# Altium schematic sheet led_VDC.SchDoc
size A; SheetNumber: 12; SheetTotal: 12; SPICEModelCacheQAAZNQEN: <root> / <DocumentId>QAAZNQEN</DocumentId> / <CacheFrame Number="0"> / <Model Name="led0" Kind="MDL"> / <Text>*Typ INFRARED GaAs LED: Vf=1.2V Vr=5V If=40mA trr=3uS / *LED Pinout: 1=A, 2=K / .MODEL LED0 D (IS=93.5P RS=84M N=2.63 BV=5 IBV=10U / + CJO=2.97P VJ=.75 M=.333 TT=4.32U)</Text> / </Model> / </CacheFrame> / </root>
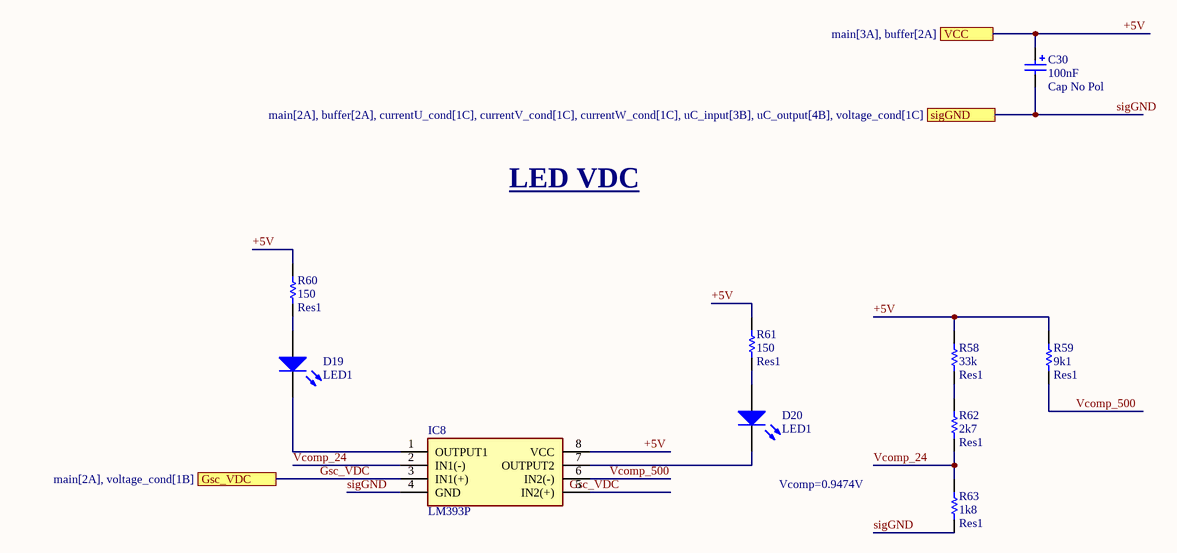
[diagram p0: led_VDC.SchDoc]

## Parts
C30  Cap No Pol  value 100nF  [RAD-0.1_mod]
D19  LED1  [PIN2_mod]
D20  LED1  [PIN2_mod]
IC8  LM393P  [DIP-8_mod]
R58  Res1  value 33k  [AXIAL-0.3_mod]
R59  Res1  value 9k1  [AXIAL-0.3_mod]
R60  Res1  value 150  [AXIAL-0.3_mod]
R61  Res1  value 150  [AXIAL-0.3_mod]
R62  Res1  value 2k7  [AXIAL-0.3_mod]
R63  Res1  value 1k8  [AXIAL-0.3_mod]

## Ports
Gsc_VDC (see main[2A], voltage_cond[1B]), sigGND (see main[2A], buffer[2A], currentU_cond[1C], currentV_cond[1C], currentW_cond[1C], uC_input[3B], uC_output[4B], voltage_cond[1C]), VCC (see main[3A], buffer[2A])

## Nets
+5V: C30.1 IC8.8(VCC) R58.2 R59.2 R60.2 R61.2 ; port VCC
Gsc_VDC: IC8.3(IN1(+)) IC8.5(IN2(+)) ; port Gsc_VDC
sigGND: C30.2 IC8.4(GND) R63.1 ; port sigGND
Vcomp_24: IC8.2(IN1(-)) R62.1 R63.2
Vcomp_500: IC8.6(IN2(-)) R59.1
NetD19_1: D19.1(A) R60.1
NetD19_2: D19.2(K) IC8.1(OUTPUT1)
NetD20_1: D20.1(A) R61.1
NetD20_2: D20.2(K) IC8.7(OUTPUT2)
NetR58_1: R58.1 R62.2

## Notes on the sheet
- LED VDC
- Vcomp=0.9474V

## Library data of the parts
C30 = Cap No Pol: Polarized Capacitor (Radial); Published: 8-Jun-2000; LatestRevisionDate: 17-Jul-2002; LatestRevisionNote: Re-released for DXP Platform.; PackageReference: RB7.6-15; Publisher: Altium Limited; PackageDescription: Polarized Capacitor (Radial); 2 Leads
D19 D20 = LED1: Typical RED GaAs LED; Published: 8-Jun-2000; LatestRevisionDate: 08-Jul-2005; LatestRevisionNote: Mech Layer 1 removed.; PackageReference: LED-1; Publisher: Altium Limited; PackageDescription: LED; 2 Leads
IC8 = LM393N: Integrated Circuit; Manufacturer_Name: Texas Instruments; Datasheet Link: https://datasheet.datasheetarchive.com/originals/distributors/Datasheets-SFU2/DSASFU100036444.pdf; Height: 5.33mm; Manufacturer_Part_Number: LM393N; Mouser Part Number: 926-LM393N; Mouser Price/Stock: https://www.mouser.co.uk/ProductDetail/Texas-Instruments/LM393N?qs=QbsRYf82W3HvgSG%252BWhL68w%3D%3D
R58-R63 = Res1: Resistor; Published: 8-Jun-2000; LatestRevisionDate: 17-Jul-2002; LatestRevisionNote: Re-released for DXP Platform.; PackageReference: AXIAL-0.3; Publisher: Altium Limited; PackageDescription: Axial Device, Thru-Hole; 2 Leads; 0.3 in Pin Spacing